# Altium project 梯控.PrjPCB
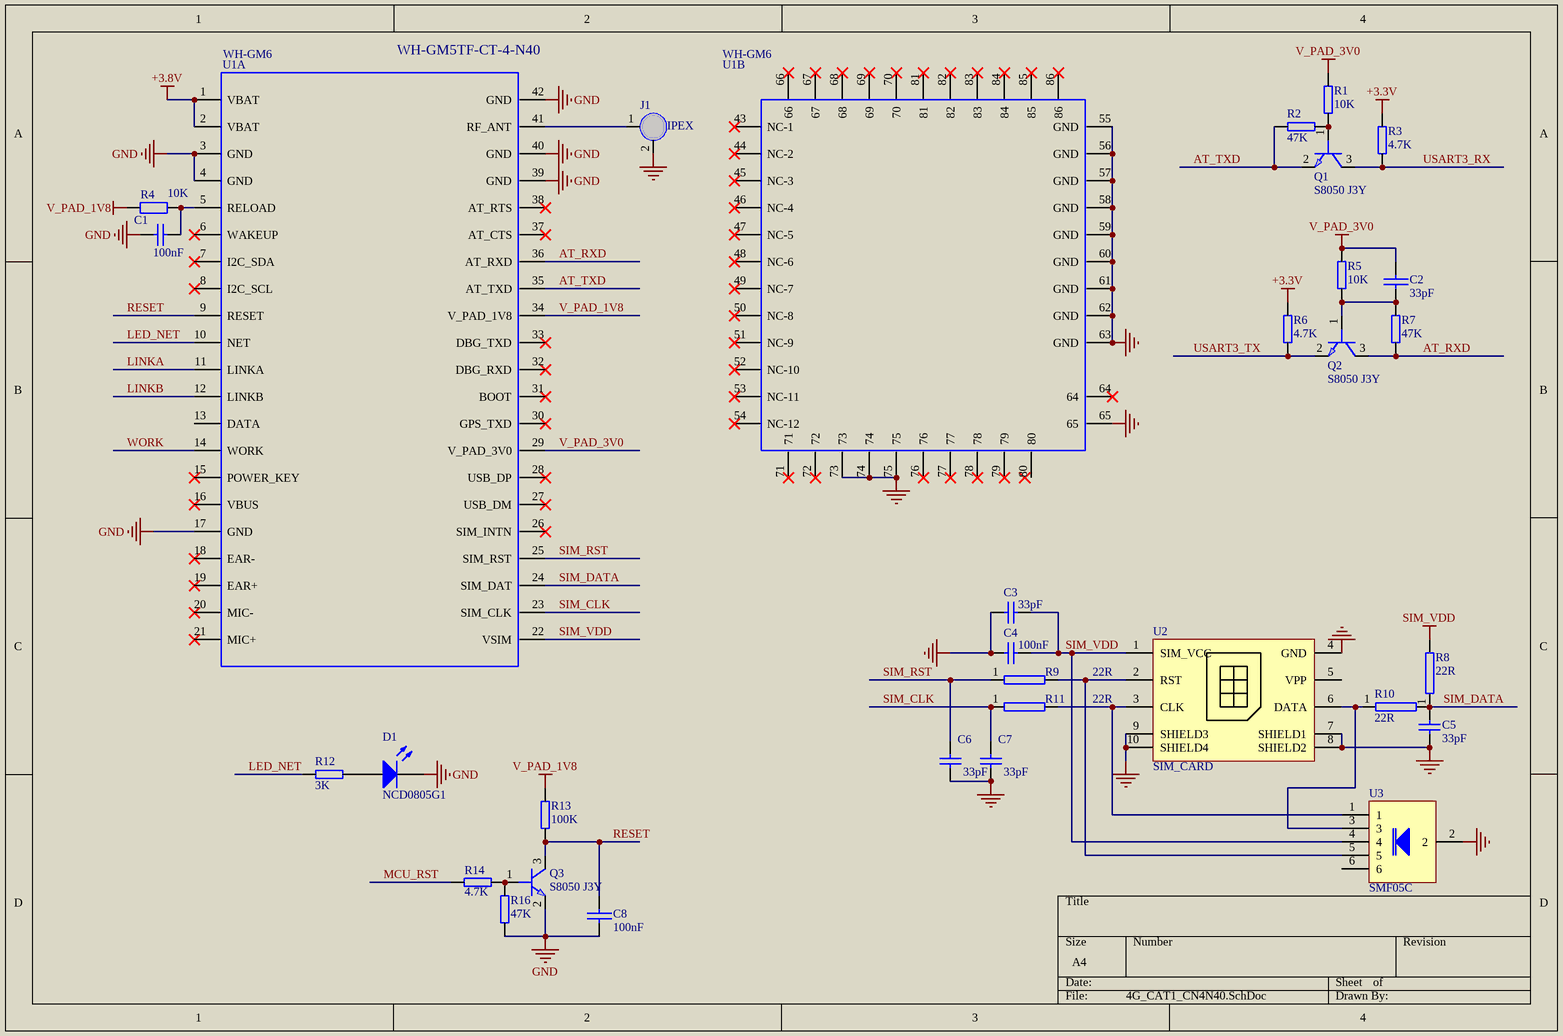
[diagram p0: 4G_CAT1_CN4N40.SchDoc]
4 sheets, 172 parts. Net scope: global (net labels, ports and power ports of the same name join across sheets).
Board file: PCBV1.0.PcbDoc
Sheets:
  4G_CAT1_CN4N40.SchDoc
  interface.SchDoc
  mcu.SchDoc
  power.SchDoc

## Sheet 4G_CAT1_CN4N40.SchDoc
size A4

### Parts
C1  100nF  [LC-0805_C]
C2  33pF  [LC-0805_C]
C3  33pF  [LC-0805_C]
C4  100nF  [LC-0805_C]
C5  33pF  [LC-0805_C]
C6  33pF  [LC-0805_C]
C7  33pF  [LC-0805_C]
C8  100nF  [LC-0805_C]
D1  NCD0805G1  [LC-0805_LED_S1]
J1  IPEX  [ANT-TH_KH-SMA-K513-G]
Q1  S8050 J3Y  [SOT-23]
Q2  S8050 J3Y  [SOT-23]
Q3  S8050 J3Y  [SOT-23]
R1  10K  [LC-0805_R]
R2  47K  [LC-0805_R]
R3  4.7K  [LC-0805_R]
R4  10K  [LC-0805_R]
R5  10K  [LC-0805_R]
R6  4.7K  [LC-0805_R]
R7  47K  [LC-0805_R]
R8  22R  [LC-0805_R]
R9  22R  [LC-0805_R]
R10  22R  [LC-0805_R]
R11  22R  [LC-0805_R]
R12  3K  [LC-0805_R]
R13  100K  [LC-0805_R]
R14  4.7K  [LC-0805_R]
R16  47K  [LC-0805_R]
U1  WH-GM6  [WH-GM6]  (parts A,B of 2)
U2  SIM_CARD  [SIM_MICRO_6P]
U3  SMF05C  [SOT-363]

### Nets
+3.3V: R3.1 R6.1
+3.8V: U1.1(VBAT) U1.2(VBAT)
GND: C1.1 C3.1 C4.1 C5.2 C6.2 C7.2 C8.2 D1.2(K) J1.2 Q3.2(E) R16.1 U1.3(GND) U1.4(GND) U1.17(GND) U1.39(GND) U1.40(GND) U1.42(GND) U1.55(GND) U1.56(GND) U1.57(GND) U1.58(GND) U1.59(GND) U1.60(GND) U1.61(GND) U1.62(GND) U1.63(GND) U1.65 U1.73 U1.74 U1.75 U2.4(GND) U2.7(SHIELD1) U2.8(SHIELD2) U2.9(SHIELD3) U2.10(SHIELD4) U3.2
SIM_VDD: C3.2 C4.2 R8.2 U1.22(VSIM) U2.1(SIM_VCC) U3.4
V_PAD_1V8: R4.2 R13.2 U1.34(V_PAD_1V8)
V_PAD_3V0: C2.1 R1.1 R5.1 U1.29(V_PAD_3V0)
AT_RXD: Q2.3(C) R7.1 U1.36(AT_RXD)
AT_TXD: Q1.2(E) R2.1 U1.35(AT_TXD)
LED_NET: R12.2 U1.10(NET)
LINKA: U1.11(LINKA)
LINKB: U1.12(LINKB)
MCU_RST: R14.1
RESET: C8.1 Q3.3(C) R13.1 U1.9(RESET)
SIM_CLK: C7.1 R11.1 U1.23(SIM_CLK)
SIM_DATA: C5.1 R8.1 R10.2 U1.24(SIM_DAT)
SIM_RST: C6.1 R9.1 U1.25(SIM_RST)
USART3_RX: Q1.3(C) R3.2
USART3_TX: Q2.2(E) R6.2
WORK: U1.14(WORK)
NetC1_2: C1.2 R4.1 U1.5(RELOAD)
NetC2_2: C2.2 Q2.1(B) R5.2 R7.2
NetD1_1: D1.1(A) R12.1
NetJ1_1: J1.1 U1.41(RF_ANT)
NetQ1_1: Q1.1(B) R1.2 R2.2
NetQ3_1: Q3.1(B) R14.2 R16.2
NetR9_2: R9.2 U2.2(RST) U3.5
NetR10_1: R10.1 U2.6(DATA) U3.3
NetR11_2: R11.2 U2.3(CLK) U3.1

Not connected (* = marked no-connect by the designer): U1 6(WAKEUP)* 7(I2C_SDA)* 8(I2C_SCL)* 13(DATA) 15(POWER_KEY)* 16(VBUS)* 18(EAR-)* 19(EAR+)* 20(MIC-)* 21(MIC+)* 26(SIM_INTN)* 27(USB_DM)* 28(USB_DP)* 30(GPS_TXD)* 31(BOOT)* 32(DBG_RXD)* 33(DBG_TXD)* 37(AT_CTS)* 38(AT_RTS)* 43(NC-1)* 44(NC-2)* 45(NC-3)* 46(NC-4)* 47(NC-5)* 48(NC-6)* 49(NC-7)* 50(NC-8)* 51(NC-9)* 52(NC-10)* 53(NC-11)* 54(NC-12)* 64* 66* 67* 68* 69* 70* 71* 72* 76* 77* 78* 79* 80 81* 82* 83* 84* 85* 86*; U2 5(VPP); U3 6

### Notes on the sheet
- (near U1) WH-GM5TF-CT-4-N40

### Library data of the parts
C1 C2 C4 C8 = CAP: Capacitor
  C1 C4: Published: 8-Jun-2000; Revision: July-2002: Re-released for DXP Platform.; Publisher: Altium Limited; Value: 100nF
C3 C5-C7 = CAP: Capacitor; Value: 100nF; Published: 8-Jun-2000; Revision: July-2002: Re-released for DXP Platform.; Publisher: Altium Limited
D1 = LED2: Typical RED, GREEN, YELLOW, AMBER GaAs LED; Published: 8-Jun-2000; LatestRevisionDate: 17-Jul-2002; LatestRevisionNote: Re-released for DXP Platform.; PackageVersion: Feb-2002; PackageReference: 3.2X1.6X1.1; Publisher: Altium Limited; PackageDescription: SM LED; 2 Flat Leads
Q1-Q3 = 2N5551: Text Field1: 20; Text Field2: 20
R1-R3 R5-R7 R12-R14 R16 = RES22: 1K
R4 = Res2: Resistor; Value: 1K; Published: 8-Jun-2000; LatestRevisionDate: 17-Jul-2002; LatestRevisionNote: Re-released for DXP Platform.; PackageReference: AXIAL-0.4; Publisher: Altium Limited; PackageDescription: Axial Device, Thru-Hole; 2 Leads; 0.4 in Pin Spacing
R8-R11 = RES2
U1 = WH-GM6: PCB DECAL: WH-GM6

## Sheet interface.SchDoc
size A4
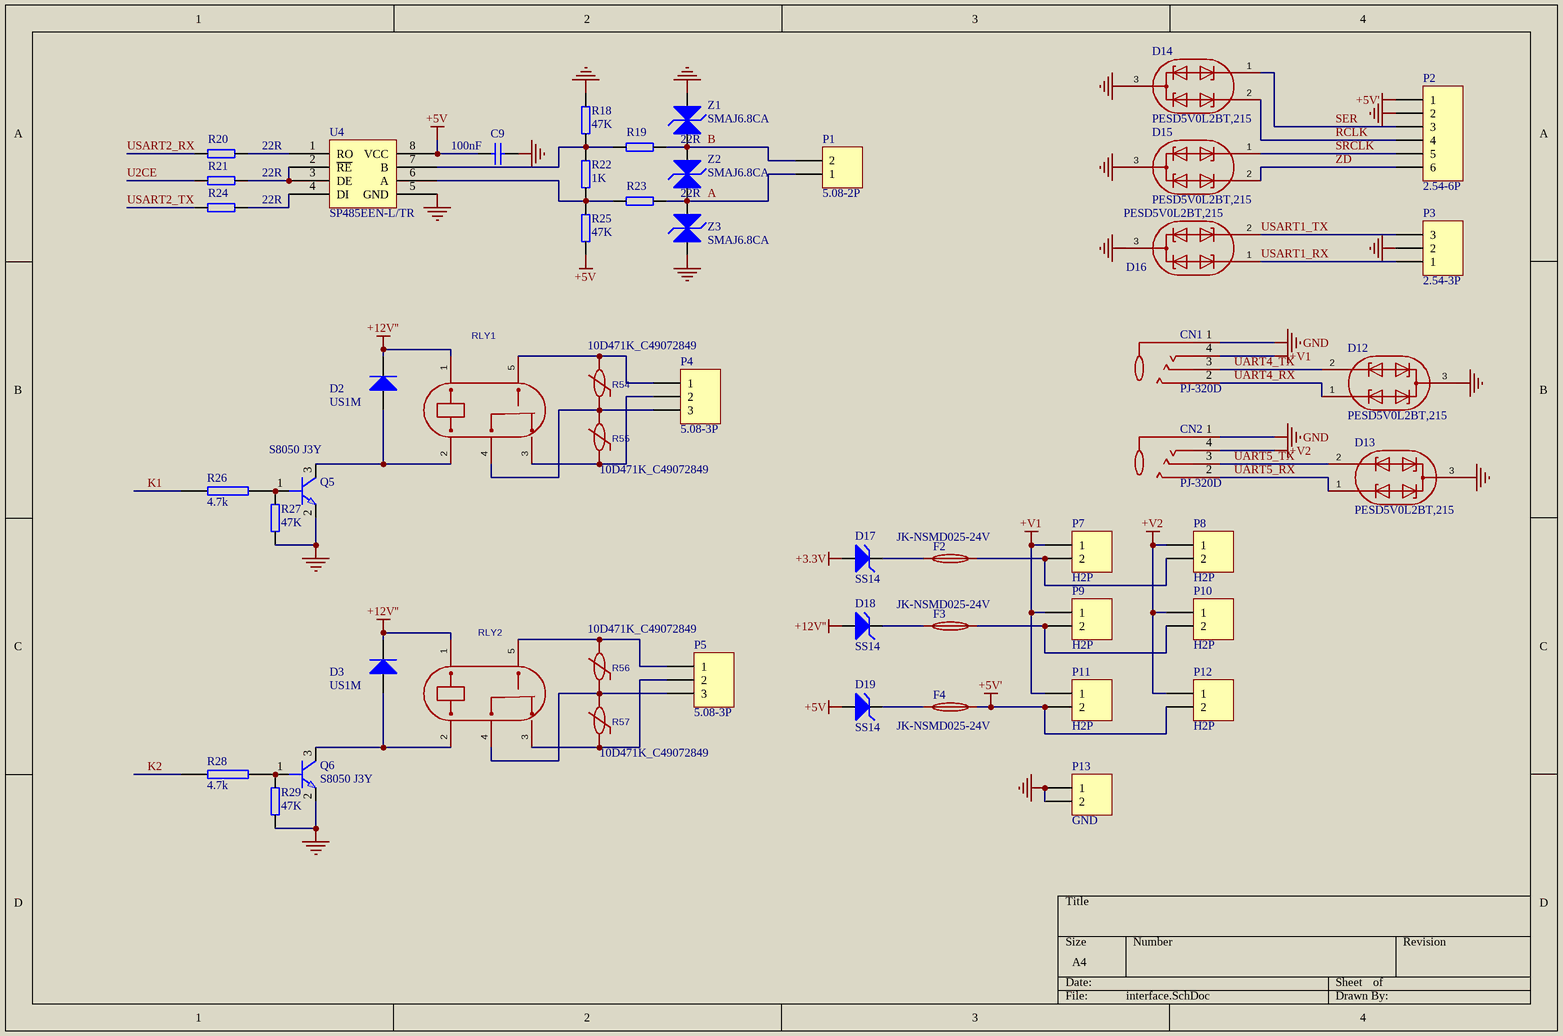
[diagram p1: interface.SchDoc]

### Parts
C9  100nF  [LC-0805_C]
CN1  PJ-320D  [4PIN]
CN2  PJ-320D  [4PIN]
D2  US1M  [LC-SMA(DO-214AC)_S2]
D3  US1M  [LC-SMA(DO-214AC)_S2]
D12  PESD5V0L2BT,215  [SOT-23]
D13  PESD5V0L2BT,215  [SOT-23]
D14  PESD5V0L2BT,215  [SOT-23]
D15  PESD5V0L2BT,215  [SOT-23]
D16  PESD5V0L2BT,215  [SOT-23]
D17  SS14  [LC-SMA(DO-214AC)_S5]
D18  SS14  [LC-SMA(DO-214AC)_S5]
D19  SS14  [LC-SMA(DO-214AC)_S5]
F2  JK-NSMD025-24V  [LC-1206_R]
F3  JK-NSMD025-24V  [LC-1206_R]
F4  JK-NSMD025-24V  [LC-1206_R]
P1  5.08-2P  [MKDSN_2RMI]
P2  2.54-6P  [6PIN]
P3  2.54-3P  [3PIN]
P4  5.08-3P  [5.08-3P]
P5  5.08-3P  [5.08-3P]
P7  H2P  [HDR1X2]
P8  H2P  [HDR1X2]
P9  H2P  [HDR1X2]
P10  H2P  [HDR1X2]
P11  H2P  [HDR1X2]
P12  H2P  [HDR1X2]
P13  GND  [HDR1X2]
Q5  S8050 J3Y  [SOT-23]
Q6  S8050 J3Y  [SOT-23]
R18  47K  [LC-0805_R]
R19  22R  [LC-0805_R]
R20  22R  [LC-0805_R]
R21  22R  [LC-0805_R]
R22  1K  [LC-0805_R]
R23  22R  [LC-0805_R]
R24  22R  [LC-0805_R]
R25  47K  [LC-0805_R]
R26  4.7k  [LC-0805_R]
R27  47K  [LC-0805_R]
R28  4.7k  [LC-0805_R]
R29  47K  [LC-0805_R]
R54  10D471K_C49072849  [RES-TH_L11.0-W6.0-P7.50]
R55  10D471K_C49072849  [RES-TH_L11.0-W6.0-P7.50]
R56  10D471K_C49072849  [RES-TH_L11.0-W6.0-P7.50]
R57  10D471K_C49072849  [RES-TH_L11.0-W6.0-P7.50]
RLY1  JQC-3FF/12VDC-1ZS(551)  (value not drawn)
RLY2  JQC-3FF/12VDC-1ZS(551)  (value not drawn)
U4  SP485EEN-L/TR  [LC-SOIC-8_150mil]
Z1  SMAJ6.8CA  [1812]
Z2  SMAJ6.8CA  [1812]
Z3  SMAJ6.8CA  [1812]

### Nets
+3.3V: D17.1(A)
+5V: C9.2 D19.1(A) R25.1 U4.8(VCC)
+5V': F4.2 P2.1 P11.2 P12.2
+12V'': D2.2(K) D3.2(K) D18.1(A) RLY1.1 RLY2.1
+V1: CN1.4 P7.1 P9.1 P11.1
+V2: CN2.4 P8.1 P10.1 P12.1
GND: C9.1 CN1.1 CN2.1 D12.3(DC) D13.3(DC) D14.3(DC) D15.3(DC) D16.3(DC) P2.2 P3.2 P13.1 P13.2 Q5.2(E) Q6.2(E) R18.2 R27.1 R29.1 U4.5(GND) Z1.1 Z3.2
A: P1.1 R23.2 Z2.2 Z3.1
B: P1.2 R19.2 Z1.2 Z2.1
K1: R26.1
K2: R28.1
RCLK: D14.2(C2) P2.4
SER: D14.1(C1) P2.3
SRCLK: D15.1(C1) P2.5
U2CE: R21.1
UART4_RX: CN1.2 D12.1(C1)
UART4_TX: CN1.3 D12.2(C2)
UART5_RX: CN2.2 D13.1(C1)
UART5_TX: CN2.3 D13.2(C2)
USART1_RX: D16.1(C1) P3.1
USART1_TX: D16.2(C2) P3.3
USART2_RX: R20.1
USART2_TX: R24.1
ZD: D15.2(C2) P2.6
NetD2_1: D2.1(A) Q5.3(C) RLY1.2
NetD3_1: D3.1(A) Q6.3(C) RLY2.2
NetD17_2: D17.2(K) F2.1
NetD18_2: D18.2(K) F3.1
NetD19_2: D19.2(K) F4.1
NetF2_2: F2.2 P7.2 P8.2
NetF3_2: F3.2 P9.2 P10.2
NetP4_1: P4.1 R54.2 RLY1.5
NetP4_2: P4.2 R55.1 RLY1.3
NetP4_3: P4.3 R54.1 R55.2 RLY1.4
NetP5_1: P5.1 R56.2 RLY2.5
NetP5_2: P5.2 R57.1 RLY2.3
NetP5_3: P5.3 R56.1 R57.2 RLY2.4
NetQ5_1: Q5.1(B) R26.2 R27.2
NetQ6_1: Q6.1(B) R28.2 R29.2
NetR18_1: R18.1 R19.1 R22.2 U4.7(B)
NetR20_2: R20.2 U4.1(RO)
NetR21_2: R21.2 U4.2(~{RE}) U4.3(DE)
NetR22_1: R22.1 R23.1 R25.2 U4.6(A)
NetR24_2: R24.2 U4.4(DI)

### Library data of the parts
C9 = CAP: Capacitor; Published: 8-Jun-2000; Revision: July-2002: Re-released for DXP Platform.; Publisher: Altium Limited; Value: 100nF
CN1 CN2 = PJ-320D_C431535: Manufacturer: SHOU HAN(首韩); Add into BOM: yes; Connector Type: 3.5mm耳机座; Current Rating (Max): 500mA; Voltage Rating (Max): 50V; Symbol: PJ-320D; Device: PJ-320D_C431535; LCSC Part Name: 3.5mm耳机座; Supplier Part: C431535; Manufacturer Part: PJ-320D; Supplier Footprint: SMD; JLCPCB Part Class: Extended Part; Datasheet: https://atta.szlcsc.com/upload/public/pdf/source/20190925/C431535_8B274506621F6117FB020BF07A197848.pdf; Supplier: LCSC; Convert to PCB: yes; Contact Material: 铜; Contact Plating: 银; Operating Temperature Range: -30℃~+70℃
D2 D3 = Diode: Default Diode; Published: 8-Jun-2000; LatestRevisionDate: 17-Jul-2002; LatestRevisionNote: Re-released for DXP Platform.; PackageVersion: Sep-1996; PackageReference: SMC; Publisher: Altium Limited; PackageDescription: DO-214-AB/SMC; 2 C-Bend Leads; Body 7.9 x 5.9 mm, inc. leads (LxW); Code_JEDEC: DO-214-AB
D17-D19 = CONSTANT: constant diode
F2-F4 = JK-MSMD110-24V: Manufacturer: JK(金科); Add into BOM: yes; Voltage - Max: 24V; Current - Max: 100A; Hold Current: 1.1A; Trip Current: 2.2A; Resistance - Initial (Ri) (Min): 50mΩ; Resistance - Post Trip (R1) (Max): 250mΩ; Time to Trip(Max): 300ms; Symbol: JK-MSMD110-24V; Device: JK-MSMD110-24V; LCSC Part Name: 24V 1.1A 1812自恢复; Supplier Part: C369172; Manufacturer Part: JK-MSMD110-24V; Supplier Footprint: 1812; JLCPCB Part Class: 扩展库; Datasheet: https://item.szlcsc.com/datasheet/JK-MSMD110-24V/343085.html; Supplier: LCSC; Convert to PCB: yes; Operating Temperature: -40℃~+85℃; Length: 4.73mm; Width: 3.41mm; Height: 1.3mm; Pitch: -
P1 P7-P13 = Header 2: Header, 2-Pin; LatestRevisionDate: 17-Jul-2002; LatestRevisionNote: Re-released for DXP Platform.; Publisher: Altium Limited
P2 = Header 6: Header, 6-Pin; LatestRevisionDate: 17-Jul-2002; LatestRevisionNote: Re-released for DXP Platform.; Publisher: Altium Limited
P3-P5 = Header 3: Header, 3-Pin; LatestRevisionDate: 17-Jul-2002; LatestRevisionNote: Re-released for DXP Platform.; Publisher: Altium Limited
Q5 Q6 = 2N5551: Text Field1: 20; Text Field2: 20
R18 R20 R21 R23-R25 R27 R29 = RES22: 1K
R19 R22 = RES22
R26 R28 = RES2
R54-R57 = 14D471K_C49069733: Symbol: 14D471K_C49069733
U4 = MAX483: *
Z1-Z3 = BANQIAO: DIODE BRIDGE
D12-D16 = PESD5V0L2BT,215: Symbol: PESD5V0L2BT,215
RLY1 RLY2 = JQC-3FF/12VDC-1ZS(551): Symbol: JQC-3FF/12VDC-1ZS(551)

## Sheet mcu.SchDoc
size A3
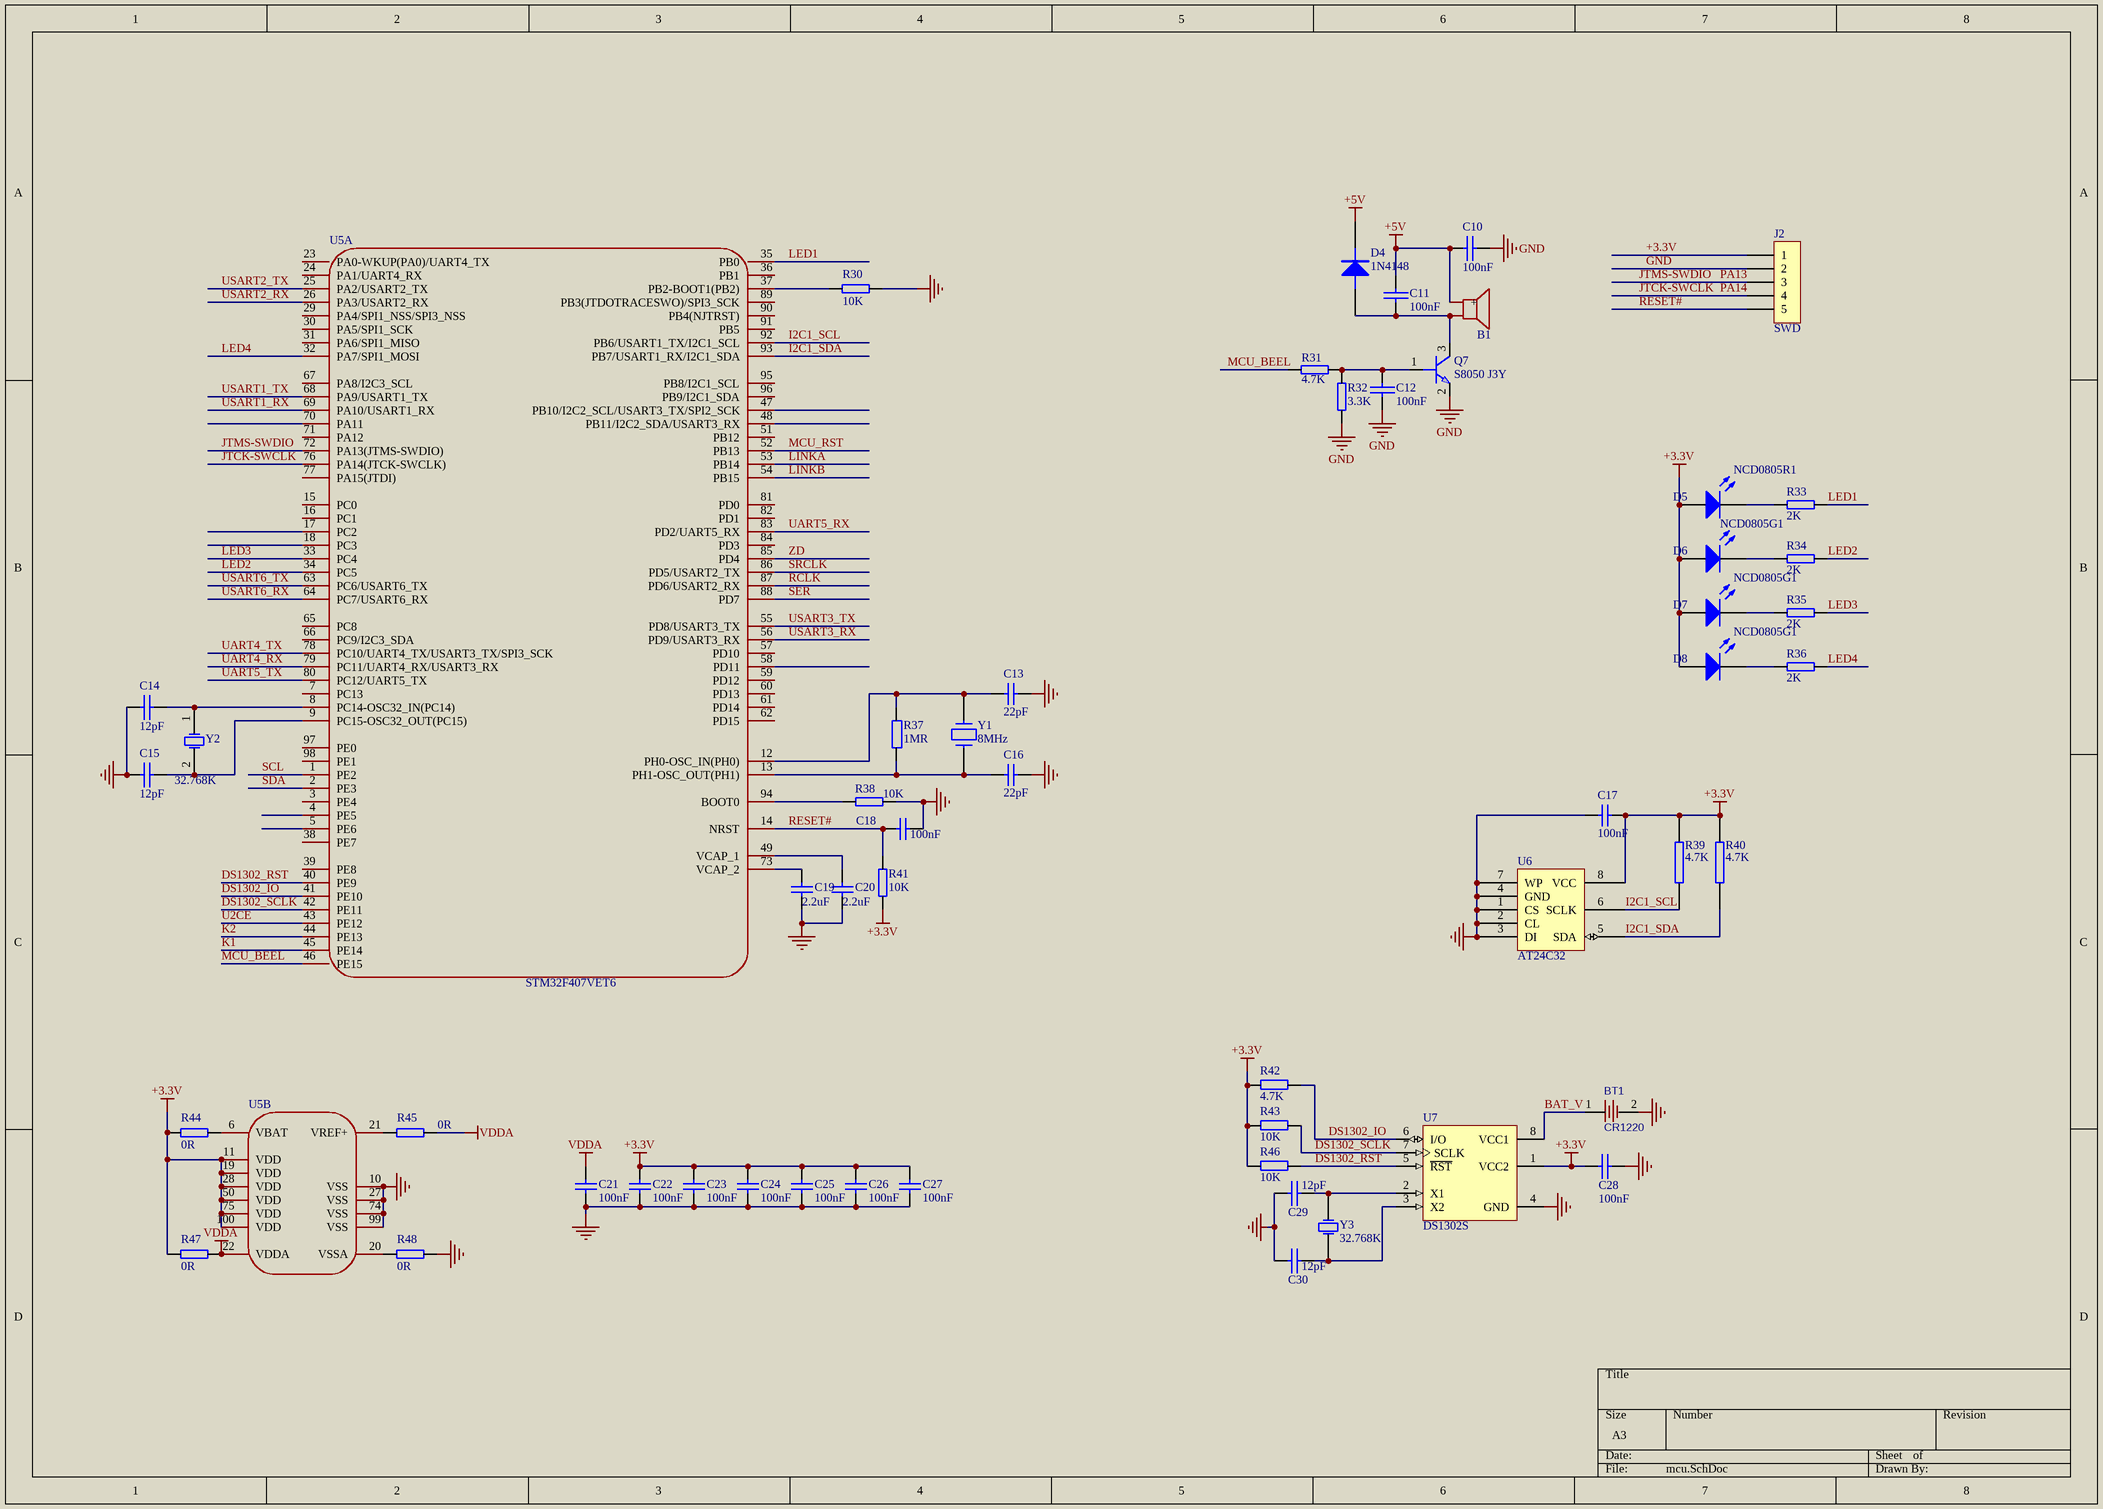
[diagram p2: mcu.SchDoc]

### Parts
B1  2.4kHz  [BUZ-TH_BD12.0-P7.60-D0.6-FD]  (value not drawn)
BT1  CR1220  [BAT-SMD_CR1220-2]
C10  100nF  [LC-0805_C]
C11  100nF  [LC-0805_C]
C12  100nF  [LC-0805_C]
C13  22pF  [LC-0805_C]
C14  12pF  [LC-0805_C]
C15  12pF  [LC-0805_C]
C16  22pF  [LC-0805_C]
C17  100nF  [LC-0805_C]
C18  100nF  [LC-0805_C]
C19  2.2uF  [LC-0805_C]
C20  2.2uF  [LC-0805_C]
C21  100nF  [LC-0805_C]
C22  100nF  [LC-0805_C]
C23  100nF  [LC-0805_C]
C24  100nF  [LC-0805_C]
C25  100nF  [LC-0805_C]
C26  100nF  [LC-0805_C]
C27  100nF  [LC-0805_C]
C28  100nF  [LC-0805_C]
C29  12pF  [LC-0805_C]
C30  12pF  [LC-0805_C]
D4  1N4148  [LC-SOD-123]
D5  NCD0805R1  [LC-0805_LED_S1]
D6  NCD0805G1  [LC-0805_LED_S1]
D7  NCD0805G1  [LC-0805_LED_S1]
D8  NCD0805G1  [LC-0805_LED_S1]
J2  SWD  [HDR1X5]
Q7  S8050 J3Y  [SOT-23]
R30  10K  [LC-0805_R]
R31  4.7K  [LC-0805_R]
R32  3.3K  [LC-0805_R]
R33  2K  [LC-0805_R]
R34  2K  [LC-0805_R]
R35  2K  [LC-0805_R]
R36  2K  [LC-0805_R]
R37  1MR  [LC-0805_R]
R38  10K  [LC-0805_R]
R39  4.7K  [LC-0805_R]
R40  4.7K  [LC-0805_R]
R41  10K  [LC-0805_R]
R42  4.7K  [LC-0805_R]
R43  10K  [LC-0805_R]
R44  0R  [LC-0805_R]
R45  0R  [LC-0805_R]
R46  10K  [LC-0805_R]
R47  0R  [LC-0805_R]
R48  0R  [LC-0805_R]
U5  STM32F407VET6  [LC-LQFP-100_14x14x05P]  (parts A,B of 2)
U6  AT24C32  [LC-SOIC-8_150mil]
U7  DS1302S  [LC-SOIC-8_150mil]
Y1  8MHz  [XTALSO]
Y2  32.768K  [LC-SMD-3215_2P FC - 135]
Y3  32.768K  [LC-SMD-3215_2P FC - 135]

### Nets
+3.3V: C17.1 C22.2 C23.2 C24.2 C25.2 C26.2 C27.2 C28.1 D5.1(A) D6.1(A) D7.1(A) D8.1(A) J2.1 R39.2 R40.2 R41.1 R42.2 R43.2 R44.1 R46.2 R47.1 U5.11(VDD) U5.19(VDD) U5.28(VDD) U5.50(VDD) U5.75(VDD) U5.100(VDD) U6.8(VCC) U7.1(VCC2)  [also labelled VCC]
+5V: B1.1(+) C10.1 C11.1 D4.2(K)
GND: BT1.2 C10.2 C12.2 C13.1 C14.1 C15.1 C16.2 C17.2 C18.2 C19.1 C20.1 C21.1 C22.1 C23.1 C24.1 C25.1 C26.1 C27.1 C28.2 C29.1 C30.1 J2.2 Q7.2(E) R30.2 R32.1 R38.2 R48.2 U5.10(VSS) U5.27(VSS) U5.74(VSS) U5.99(VSS) U6.1(CS) U6.2(CL) U6.3(DI) U6.4(GND) U6.7(WP) U7.4(GND)
VDDA: C21.2 R45.2 R47.2 U5.22(VDDA)
BAT_V: BT1.1 U7.8(VCC1)
DS1302_IO: R42.1 U5.41(PE10) U7.6(I/O)
DS1302_RST: R46.1 U5.40(PE9) U7.5(~{RST})
DS1302_SCLK: R43.1 U5.42(PE11) U7.7(SCLK)
I2C1_SCL: R39.1 U5.92(PB6/USART1_TX/I2C1_SCL) U6.6(SCLK)
I2C1_SDA: R40.1 U5.93(PB7/USART1_RX/I2C1_SDA) U6.5(SDA)
JTCK-SWCLK: J2.4 U5.76(PA14(JTCK-SWCLK))  [also labelled PA14]
JTMS-SWDIO: J2.3 U5.72(PA13(JTMS-SWDIO))  [also labelled PA13]
K1: U5.45(PE14)
K2: U5.44(PE13)
LED1: R33.1 U5.35(PB0)
LED2: R34.1 U5.34(PC5)
LED3: R35.1 U5.33(PC4)
LED4: R36.1 U5.32(PA7/SPI1_MOSI)
LINKA: U5.53(PB14)
LINKB: U5.54(PB15)
MCU_BEEL: R31.1 U5.46(PE15)
MCU_RST: U5.52(PB13)
RCLK: U5.87(PD6/USART2_RX)
RESET#: C18.1 J2.5 R41.2 U5.14(NRST)
SCL: U5.1(PE2)
SDA: U5.2(PE3)
SER: U5.88(PD7)
SRCLK: U5.86(PD5/USART2_TX)
U2CE: U5.43(PE12)
UART4_RX: U5.79(PC11/UART4_RX/USART3_RX)
UART4_TX: U5.78(PC10/UART4_TX/USART3_TX/SPI3_SCK)
UART5_RX: U5.83(PD2/UART5_RX)
UART5_TX: U5.80(PC12/UART5_TX)
USART1_RX: U5.69(PA10/USART1_RX)
USART1_TX: U5.68(PA9/USART1_TX)
USART2_RX: U5.26(PA3/USART2_RX)
USART2_TX: U5.25(PA2/USART2_TX)
USART3_RX: U5.56(PD9/USART3_RX)
USART3_TX: U5.55(PD8/USART3_TX)
USART6_RX: U5.64(PC7/USART6_RX)
USART6_TX: U5.63(PC6/USART6_TX)
ZD: U5.85(PD4)
NetB1_2: B1.2 C11.2 D4.1(A) Q7.3(C)
NetC12_1: C12.1 Q7.1(B) R31.2 R32.2
NetC13_2: C13.2 R37.2 U5.12(PH0-OSC_IN(PH0)) Y1.1
NetC14_2: C14.2 U5.8(PC14-OSC32_IN(PC14)) Y2.1(OSC1)
NetC15_2: C15.2 U5.9(PC15-OSC32_OUT(PC15)) Y2.2(OSC2)
NetC16_1: C16.1 R37.1 U5.13(PH1-OSC_OUT(PH1)) Y1.2
NetC19_2: C19.2 U5.73(VCAP_2)
NetC20_2: C20.2 U5.49(VCAP_1)
NetC29_2: C29.2 U7.2(X1) Y3.2(OSC2)
NetC30_2: C30.2 U7.3(X2) Y3.1(OSC1)
NetD5_2: D5.2(K) R33.2
NetD6_2: D6.2(K) R34.2
NetD7_2: D7.2(K) R35.2
NetD8_2: D8.2(K) R36.2
NetR30_1: R30.1 U5.37(PB2-BOOT1(PB2))
NetR38_1: R38.1 U5.94(BOOT0)
NetR44_2: R44.2 U5.6(VBAT)
NetR45_1: R45.1 U5.21(VREF+)
NetR48_1: R48.1 U5.20(VSSA)

Not connected (* = marked no-connect by the designer): U5 3(PE4) 4(PE5) 5(PE6) 7(PC13) 15(PC0) 16(PC1) 17(PC2) 18(PC3) 23(PA0-WKUP(PA0)/UART4_TX) 24(PA1/UART4_RX) 29(PA4/SPI1_NSS/SPI3_NSS) 30(PA5/SPI1_SCK) 31(PA6/SPI1_MISO) 36(PB1) 38(PE7) 39(PE8) 47(PB10/I2C2_SCL/USART3_TX/SPI2_SCK) 48(PB11/I2C2_SDA/USART3_RX) 51(PB12) 57(PD10) 58(PD11) 59(PD12) 60(PD13) 61(PD14) 62(PD15) 65(PC8) 66(PC9/I2C3_SDA) 67(PA8/I2C3_SCL) 70(PA11) 71(PA12) 77(PA15(JTDI)) 81(PD0) 82(PD1) 84(PD3) 89(PB3(JTDOTRACESWO)/SPI3_SCK) 90(PB4(NJTRST)) 91(PB5) 95(PB8/I2C1_SCL) 96(PB9/I2C1_SDA) 97(PE0) 98(PE1); Y3 0(GND)

### Library data of the parts
B1 = TMB12A05_C96093: Manufacturer: 华能; Add into BOM: yes; Driver Circuitry: 有源(内含驱动线路); Voltage - Supply: 4V~8V; Sound Pressure Level(SPL): 85dB; Symbol: TMB12A05; Device: TMB12A05_C96093; LCSC Part Name: TMB12A05; Supplier Part: C96093; Manufacturer Part: TMB12A05; Supplier Footprint: 插件,D=12mm; JLCPCB Part Class: Extended Part; Datasheet: https://atta.szlcsc.com/upload/public/pdf/source/20241025/8A17FE04D767D19A35A06DEF9A82AB1E.pdf; Supplier: LCSC; Convert to PCB: yes; Technology: 电磁式; Voltage Rating: -; Value: 2.4kHz; Current Consumption: -; Diameter(φD): 12mm; Length: -; Width: -; Height: 9.8mm; Operating Temperature: -
BT1 = 1056TR: BOM_Manufacturer: Keystone; Contributor: LCSC; BOM_Supplier: LCSC; BOM_Supplier Part: C238068; BOM_Manufacturer Part: 1056TR; spicePre: B; spiceSymbolName: 1056TR
C10-C12 C17 C18 C21-C27 = CAP: Capacitor
  C17 C18 C21-C27: Published: 8-Jun-2000; Revision: July-2002: Re-released for DXP Platform.; Publisher: Altium Limited; Value: 100nF
C13 C16 C19 C20 = CAP: Capacitor; Value: 100nF; Published: 8-Jun-2000; Revision: July-2002: Re-released for DXP Platform.; Publisher: Altium Limited
C14 C15 C28-C30 = 普通电容: Capacitor
D4 = DIODE
D5-D8 = LED2: as D1 on sheet 4G_CAT1_CN4N40; Published: 8-Jun-2000; LatestRevisionDate: 17-Jul-2002; LatestRevisionNote: Re-released for DXP Platform.; PackageVersion: Feb-2002; PackageReference: 3.2X1.6X1.1; Publisher: Altium Limited; PackageDescription: SM LED; 2 Flat Leads
J2 = CON5: Connector
Q7 = 2N5551: Text Field1: 20; Text Field2: 20
R30-R36 R38 R41 R44 R45 R47 R48 = RES22: 1K
R37 R42 R43 R46 = R
R39 R40 = RES2
U5 = STM32F407VET6: Manufacturer: ST(意法半导体); Add into BOM: yes; CPU Core: ARM-M4; CPU Maximum Speed: 168MHz; Program Storage Size: 512KB; Program Memory Type: FLASH; Number of I/O: 82; ADC (Bit): 12bit; Voltage - Supply: 1.8V~3.6V; Symbol: STM32F407VET6; Device: STM32F407VET6; LCSC Part Name: 带DSP和FPU的高性能基础系列ARM Cortex-M4 MCU，具有512 KB Flash、168 MHz CPU、ART加速器、以太网和FSMC; Supplier Part: C28730; Manufacturer Part: STM32F407VET6; Supplier Footprint: LQFP-100(14x14); JLCPCB Part Class: Extended Part; Datasheet: https://atta.szlcsc.com/upload/public/pdf/source/20140801/1457707197138.pdf; Supplier: LCSC; Convert to PCB: yes; DAC (Bit): 12bit; Applications: -
U6 = 24C64
U7 = DS1302S: Trickle Charge Timekeeping Chip; Published: 13-Oct-2000; LatestRevisionDate: 13-Apr-2006; LatestRevisionNote: IPC-7351 Footprint Added.; DatasheetVersion: 2-Jul-1999; PackageVersion: 1994; PackageReference: SOIC8WA; Publisher: Altium Limited; PackageDescription: 8-Pin Small Outline Package 1.27 mm Pitch; ComponentLink1Description: Manufacturer Link; ComponentLink1URL: http://www.maxim-ic.com/; ComponentLink2Description: Datasheet; ComponentLink2URL: http://pdfserv.maxim-ic.com/en/ds/DS1302.pdf; ComponentLink3Description: Discontinuation Notice; ComponentLink3URL: http://www.maxim-ic.com/qa/pdfs/non-obsolescence-letter.pdf
Y1 = CRYSTAL
Y2 Y3 = XTAL: Crystal Oscillator; Published: 8-Jun-2000; LatestRevisionDate: 17-Jul-2002; LatestRevisionNote: Re-released for DXP Platform.; PackageReference: R38; Publisher: Altium Limited; PackageDescription: Crystal, Thru-Hole; 2 Leads; Body 3.1 x 8.2 mm (Dia.xH)

## Sheet power.SchDoc
size A4
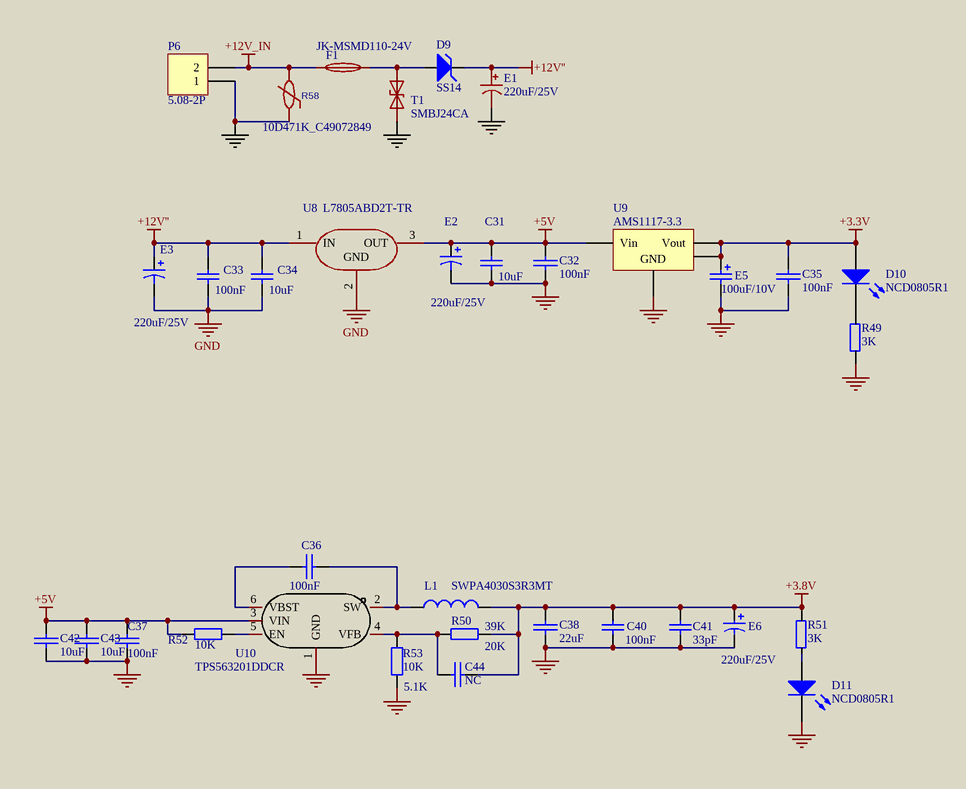
[diagram p3: power.SchDoc]

### Parts
C31  10uF  [LC-0805_C]
C32  100nF  [LC-0805_C]
C33  100nF  [LC-0805_C]
C34  10uF  [LC-0805_C]
C35  100nF  [LC-0805_C]
C36  100nF  [LC-0805_C]
C37  100nF  [LC-0805_C]
C38  22uF  [LC-1206_C]
C40  100nF  [LC-0805_C]
C41  33pF  [LC-0805_C]
C42  10uF  [LC-1206_C]
C43  10uF  [LC-1206_C]
C44  NC  [LC-0805_C]
D9  SS14  [LC-SMA(DO-214AC)_S5]
D10  NCD0805R1  [LC-0805_LED_S1]
D11  NCD0805R1  [LC-0805_LED_S1]
E1  220uF/25V  [CAP-TH_BD6.3-P2.50]
E2  220uF/25V  [CAP-TH_BD6.3-P2.50]
E3  220uF/25V  [CAP-TH_BD6.3-P2.50]
E5  100uF/10V  [3528_B]
E6  220uF/25V  [CAP-TH_BD6.3-P2.50]
F1  JK-MSMD110-24V  [F1812]
L1  SWPA4030S3R3MT  [LC-4.0*4.0]
P6  5.08-2P  [MKDSN_2RMI]
R49  3K  [LC-0805_R]
R50  39K  [LC-0805_R]
R51  3K  [LC-0805_R]
R52  10K  [LC-0805_R]
R53  10K  [LC-0805_R]
R58  10D471K_C49072849  [RES-TH_L11.0-W6.0-P7.50]
T1  SMBJ24CA  [SMB_L4.6-W3.6-LS5.3-BI]
U8  L7805ABD2T-TR  [LC-TO-263-2]
U9  AMS1117-3.3  [LC-SOT-223]
U10  TPS563201DDCR  [LC-SOT-23-6]

### Nets
+3.3V: C35.1 D10.1(A) E5.1 U9.3(Vout) U9.4(Vout)
+3.8V: C38.1 C40.1 C41.1 C44.1 E6.1 L1.2 R50.1 R51.1
+5V: C31.1 C32.1 C37.2 C42.1 C43.1 E2.1 R52.1 U8.3(OUT) U9.1(Vin) U10.3(VIN)
+12V'': C33.1 C34.1 D9.2(K) E1.1 E3.1 U8.1(IN)
+12V_IN: F1.1 P6.2 R58.2
GND: C31.2 C32.2 C33.2 C34.2 C35.2 C37.1 C38.2 C40.2 C41.2 C42.2 C43.2 D11.2(K) E1.2 E2.2 E3.2 E5.2 E6.2 P6.1 R49.2 R53.1 R58.1 T1.1(K) U8.2(GND) U9.2(GND) U10.1(GND)
NetC36_1: C36.1 U10.6(VBST)
NetC36_2: C36.2 L1.1 U10.2(SW)
NetC44_2: C44.2 R50.2 R53.2 U10.4(VFB)
NetD9_1: D9.1(A) F1.2 T1.2(A)
NetD10_2: D10.2(K) R49.1
NetD11_1: D11.1(A) R51.2
NetR52_2: R52.2 U10.5(EN)

### Notes on the sheet
- (near R50) 20K
- (near R53) 5.1K

### Library data of the parts
C31 C33 C34 = Cap: Capacitor; Value: 104; Published: 8-Jun-2000; LatestRevisionDate: 17-Jul-2002; LatestRevisionNote: Re-released for DXP Platform.; Publisher: Altium Limited
C32 C35-C38 C40 C42-C44 = CAP: Capacitor
  C40: Published: 8-Jun-2000; Revision: July-2002: Re-released for DXP Platform.; Publisher: Altium Limited; Value: 100nF
C41 = CAP: Capacitor; Value: 100nF; Published: 8-Jun-2000; Revision: July-2002: Re-released for DXP Platform.; Publisher: Altium Limited
D9 = CONSTANT: constant diode
D10 D11 = LED3: Typical BLUE SiC LED; Published: 8-Jun-2000; LatestRevisionDate: 17-Dec-2003; LatestRevisionNote: PCB Footprint replaced.; DatasheetVersion: 16-Apr-2002; PackageVersion: 16-Apr-2002; PackageReference: 3.5X2.8X1.9; Publisher: Altium Limited; PackageDescription: SM LED; 2 C-Bend Leads; Body 3.5 x 2.8 x 1.9 mm, inc leads (LxWxH typ)
E1 = 35YXJ470M10x16: Manufacturer: rubycon(红宝石); Add into BOM: yes; Value: 470uF; Tolerance: ±20%; Rated Voltage: 35V; φD: 10mm; L: 16mm; Lifetime @ Temp: 10000hrs@105℃; Symbol: 35YXJ470M10x16; Device: 35YXJ470M10x16; LCSC Part Name: 470uF ±20% 35V; Supplier Part: C88732; Manufacturer Part: 35YXJ470M10x16; Supplier Footprint: 插件,D10xL16mm; JLCPCB Part Class: 扩展库; Datasheet: https://atta.szlcsc.com/upload/public/pdf/source/20190927/C432444_D90212164DBC1B856ABE912664018FD4.pdf; Supplier: LCSC; Convert to PCB: yes; Lead Spacing: 5mm
E2 E3 = Cap Pol1: Polarized Capacitor (Radial); Published: 8-Jun-2000; LatestRevisionDate: 17-Jul-2002; LatestRevisionNote: Re-released for DXP Platform.; PackageReference: RB7.6-15; Publisher: Altium Limited
E5 = Cap Pol1: Polarized Capacitor (Radial); Value: 10uF; Published: 8-Jun-2000; Revision: July-2002: Re-released for DXP Platform.; Publisher: Altium Limited
E6 = CAP2: Bi-Polar Capacitor; Value: 470uF/10V
F1 = JK-MSMD110-24V: as F2 on sheet interface; Symbol: JK-MSMD110-24V; Device: JK-MSMD110-24V; LCSC Part Name: 24V 1.1A 1812自恢复; Supplier Part: C369172; Manufacturer Part: JK-MSMD110-24V; Supplier Footprint: 1812; JLCPCB Part Class: 扩展库; Datasheet: https://item.szlcsc.com/datasheet/JK-MSMD110-24V/343085.html; Supplier: LCSC; Convert to PCB: yes; Operating Temperature: -40℃~+85℃; Length: 4.73mm; Width: 3.41mm; Height: 1.3mm; Pitch: -
L1 = Inductor: Code_IEC: 1005; Value: 10mH; Published: 8-Jun-2000; LatestRevisionDate: 29-May-2009; LatestRevisionNote: IPC-7351 Footprint Added.; PackageReference: 0402-A; Publisher: Altium Limited; PackageDescription: Chip Inductor; Code_JEITA: 0402
P6 = Header 2: Header, 2-Pin; LatestRevisionDate: 17-Jul-2002; LatestRevisionNote: Re-released for DXP Platform.; Publisher: Altium Limited
R49 R51 = R
R50 R52 R53 = Res2: Resistor; Value: 1K; Published: 8-Jun-2000; LatestRevisionDate: 17-Jul-2002; LatestRevisionNote: Re-released for DXP Platform.; PackageReference: AXIAL-0.4; Publisher: Altium Limited; PackageDescription: Axial Device, Thru-Hole; 2 Leads; 0.4 in Pin Spacing
R58 = 14D471K_C49069733: Symbol: 14D471K_C49069733
T1 = SMBJ24CA_C78416: Manufacturer: Brightking(君耀电子); Add into BOM: yes; Reverse Stand-Off Voltage (Vrwm): 24V; Maximum Clamping Voltage: 38.9V; Peak Pulse Current (Ipp): 15.5A; Breakdown Voltage: 26.7V; Type: TVS; Symbol: SMBJ24CA_C78416; Device: SMBJ24CA_C78416; LCSC Part Name: 24V截止 15.5A峰值脉冲; Supplier Part: C78416; Manufacturer Part: SMBJ24CA; Supplier Footprint: SMB(DO-214AA); JLCPCB Part Class: 扩展库; Datasheet: https://atta.szlcsc.com/upload/public/pdf/source/20181127/C309995_EB3DFB9F9AEE5D2146ECD9FA5992A402.pdf; Supplier: LCSC; Convert to PCB: yes
U8 = L7805CV-DG: Manufacturer: ST(意法半导体); Add into BOM: yes; Output Type: 固定; Maximum Input Voltage: 35V; Output Voltage: 5V; Output Current: 1.5A; Power Supply Rejection Ratio (PSRR): 62dB@(120Hz); Dropout Voltage: 2V@(1A); standby current: 8mA; Output Polarity: 正极; Number of Outputs: 1; Symbol: L7805CV-DG; Device: L7805CV-DG; LCSC Part Name: 正稳压器IC; Supplier Part: C3795; Manufacturer Part: L7805CV-DG; Supplier Footprint: TO-220; JLCPCB Part Class: Extended Part; Datasheet: https://atta.szlcsc.com/upload/public/pdf/source/20140724/1457707163191.pdf; Supplier: LCSC; Convert to PCB: yes; Feature: 短路保护；热保护(TSD)；过流保护(OCP); Operating Temperature: 0℃~+125℃
U9 = Volt Reg: Voltage Regulator; pin to pad: 1>3 2>1 3>4 4>2; Published: 24-Mar-1999; LatestRevisionDate: 17-Jul-2002; LatestRevisionNote: Re-released for DXP Platform.; Publisher: Altium Limited; Code_JEDEC: SMD-220
U10 = TPS563201DDCR: Manufacturer: TI(德州仪器); Add into BOM: yes; Function: 降压型; Synchronous Rectification: 是; Output Type: 可调; Number of Outputs: 1; Topology: 降压式; Input Voltage: 4.5V~17V; Output Voltage: 768mV~7V; Output Current (Max): 3A; Switching Frequency: 580kHz; Name: TPS563201DDCR; Symbol: TPS563201DDCR; Device: TPS563201DDCR; LCSC Part Name: 降压型 Vin=4.5V~17V Vout=768mV~7V 3A; Supplier Part: C116592; Manufacturer Part: TPS563201DDCR; Supplier Footprint: SOT-23-Thin-6; JLCPCB Part Class: Extended Part; Datasheet: https://atta.szlcsc.com/upload/public/pdf/source/20170707/1499421477081.pdf; Supplier: LCSC; Convert to PCB: yes; Operating Temperature: -40℃~+125℃@(TJ)

## Nets that join several sheets
+3.3V: 4G_CAT1_CN4N40 (R3.1 R6.1), interface (D17.1), mcu (29 pins), power (5 pins)
+3.8V: 4G_CAT1_CN4N40 (U1.1 U1.2), power (8 pins)
+5V: interface (C9.2 D19.1 R25.1 U4.8), mcu (B1.1 C10.1 C11.1 D4.2), power (10 pins)
+12V'': interface (5 pins), power (6 pins)
GND: 4G_CAT1_CN4N40 (36 pins), interface (20 pins), mcu (37 pins), power (25 pins)
K1: interface (R26.1), mcu (U5.45)
K2: interface (R28.1), mcu (U5.44)
LINKA: 4G_CAT1_CN4N40 (U1.11), mcu (U5.53)
LINKB: 4G_CAT1_CN4N40 (U1.12), mcu (U5.54)
MCU_RST: 4G_CAT1_CN4N40 (R14.1), mcu (U5.52)
RCLK: interface (D14.2 P2.4), mcu (U5.87)
SER: interface (D14.1 P2.3), mcu (U5.88)
SRCLK: interface (D15.1 P2.5), mcu (U5.86)
U2CE: interface (R21.1), mcu (U5.43)
UART4_RX: interface (CN1.2 D12.1), mcu (U5.79)
UART4_TX: interface (CN1.3 D12.2), mcu (U5.78)
UART5_RX: interface (CN2.2 D13.1), mcu (U5.83)
UART5_TX: interface (CN2.3 D13.2), mcu (U5.80)
USART1_RX: interface (D16.1 P3.1), mcu (U5.69)
USART1_TX: interface (D16.2 P3.3), mcu (U5.68)
USART2_RX: interface (R20.1), mcu (U5.26)
USART2_TX: interface (R24.1), mcu (U5.25)
USART3_RX: 4G_CAT1_CN4N40 (Q1.3 R3.2), mcu (U5.56)
USART3_TX: 4G_CAT1_CN4N40 (Q2.2 R6.2), mcu (U5.55)
ZD: interface (D15.2 P2.6), mcu (U5.85)